# Altium schematic sheet BUS REG, BA MUX.SchDoc: DATAPATHS
size A3; Date: .Date; Author: Jeremy King; CompanyName: King Technologies; DrawnBy: Jeremy King; Engineer: Jeremy King; Organization: King Technologies; Address1: 676 Mandan Ave,; Address2: Melbourne,; Address3: FL,; Address4: 32935; DocumentNumber: 1; Revision: 1; SheetNumber: 1; SheetTotal: 3; ProjectTitle: Siena; Time: .Time
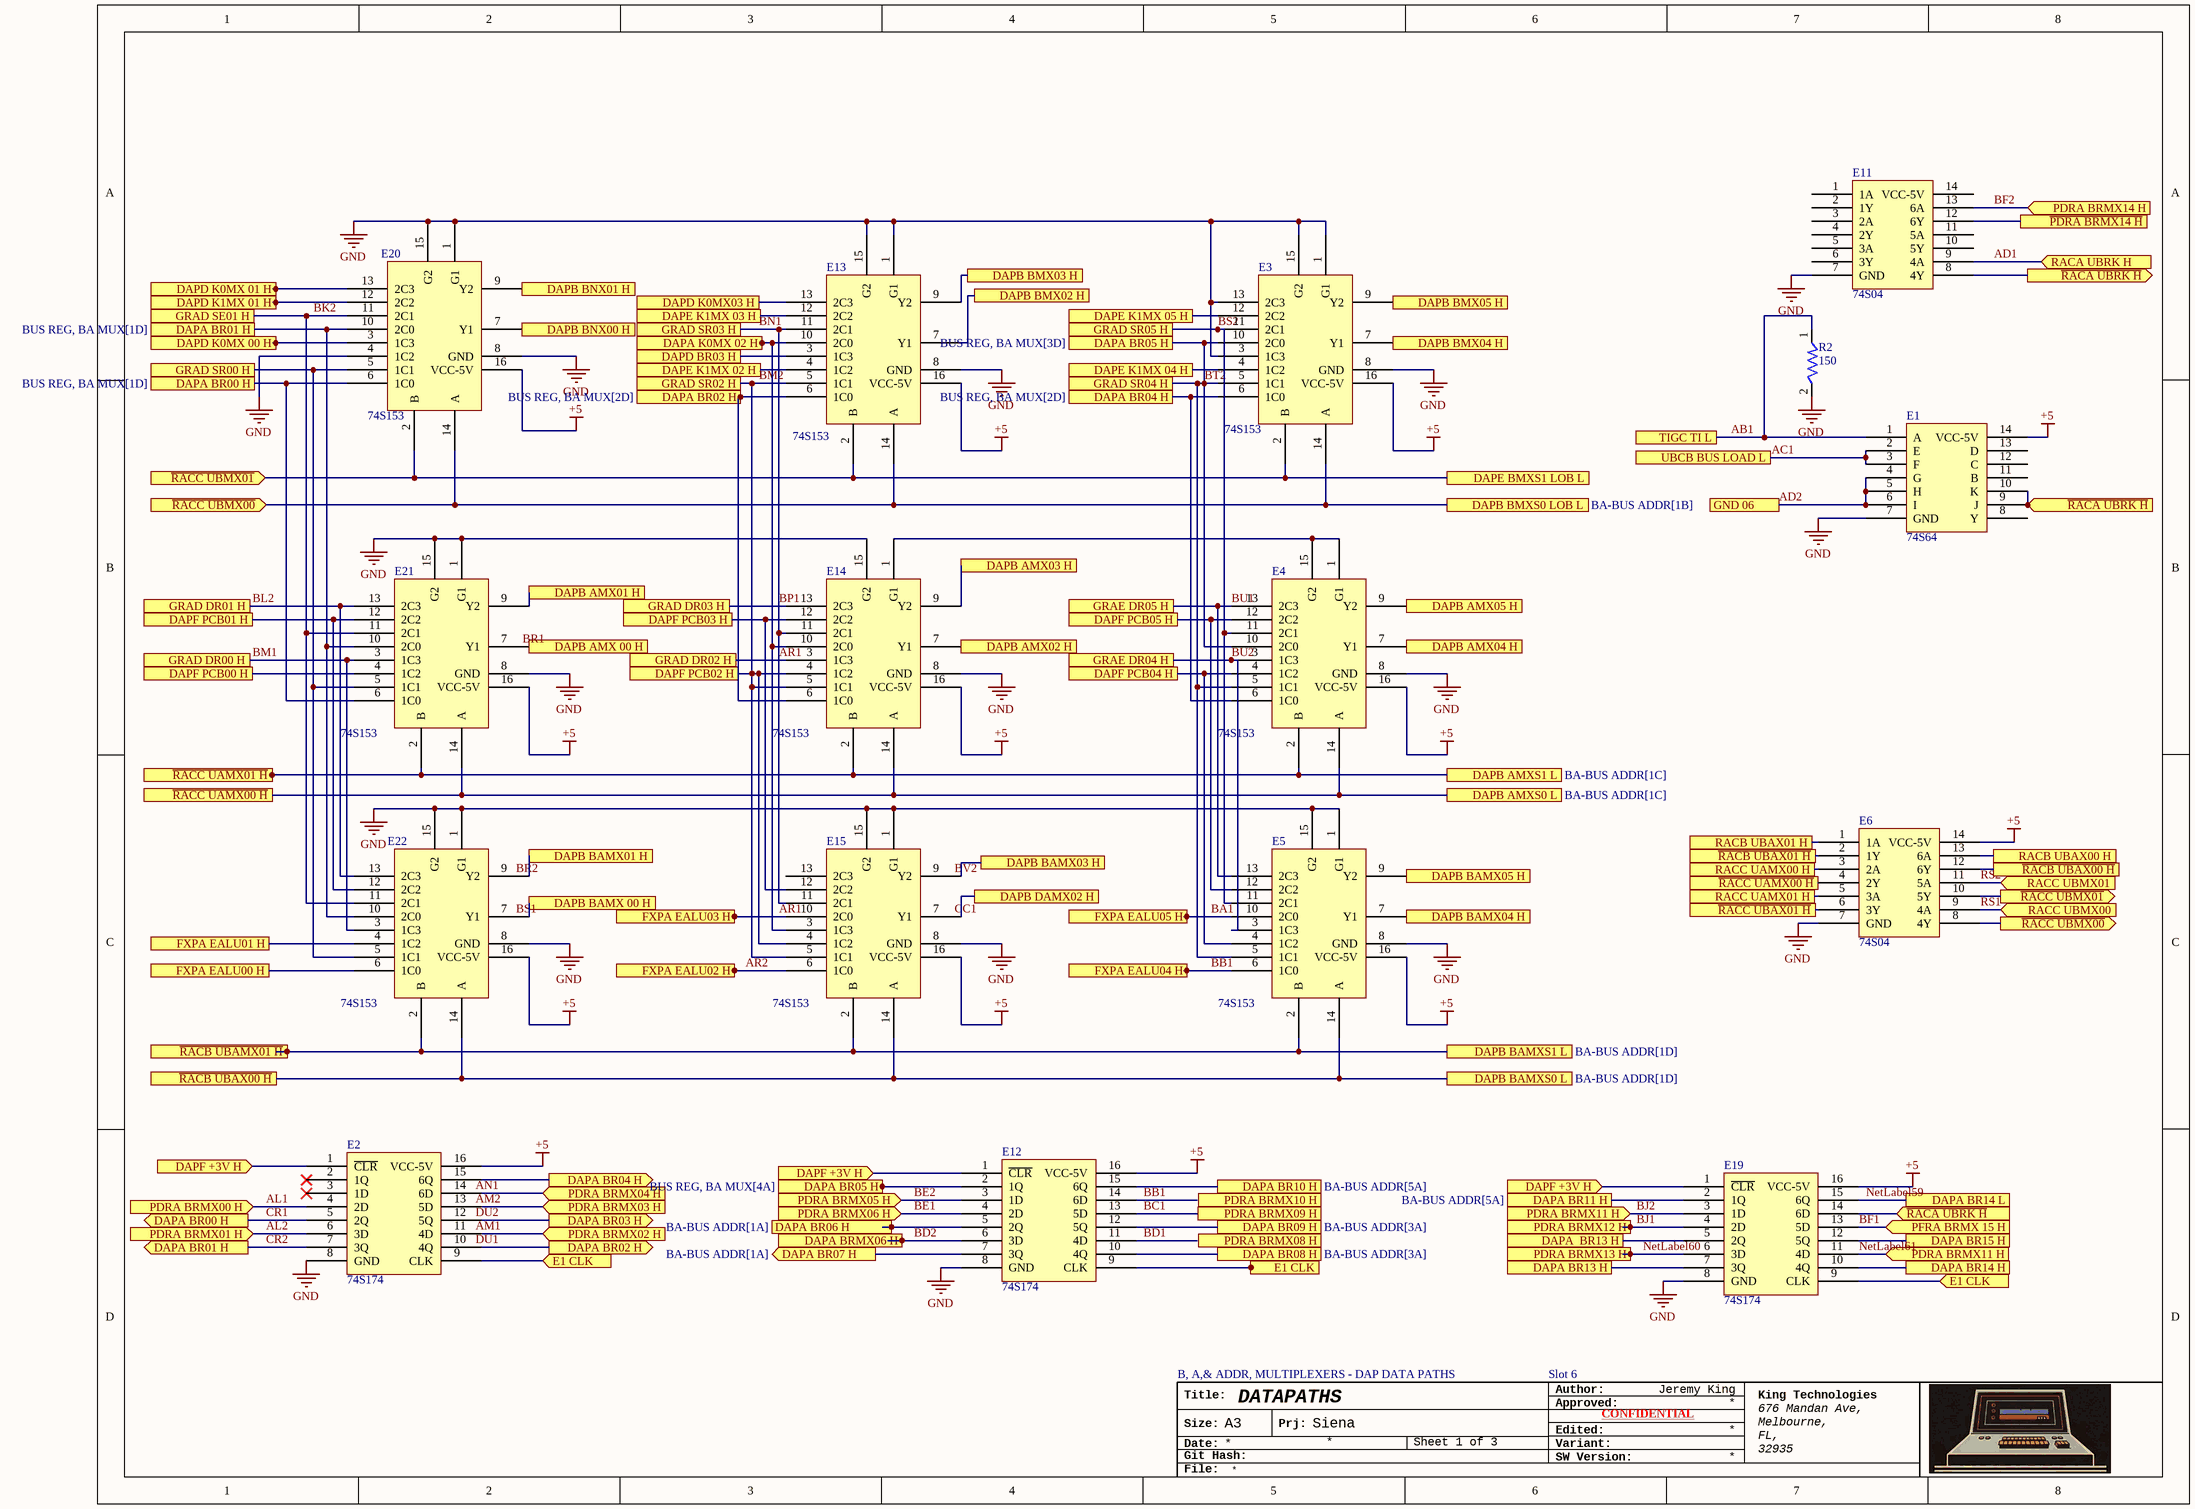
[diagram p0: BUS REG, BA MUX.SchDoc]

## Parts
E1  74S64  [DIP14]
E2  74S174  [DIP16-300]
E3  74S153  [DIP16]
E4  74S153  [DIP16]
E5  74S153  [DIP16]
E6  74S04  [DIP14]
E11  74S04  [DIP14]
E12  74S174  [DIP16-300]
E13  74S153  [DIP16]
E14  74S153  [DIP16]
E15  74S153  [DIP16]
E19  74S174  [DIP16-300]
E20  74S153  [DIP16]
E21  74S153  [DIP16]
E22  74S153  [DIP16]
R2  150  [Axial 0.6]

## Ports
DAPA  BR13 H, DAPA BR00 H (out, see BUS REG, BA MUX[1B]), DAPA BR00 H (see BUS REG, BA MUX[1D]), DAPA BR01 H (out, see BUS REG, BA MUX[1A]), DAPA BR01 H (see BUS REG, BA MUX[1D]), DAPA BR02 H (out, see BUS REG, BA MUX[3B]), DAPA BR02 H (see BUS REG, BA MUX[2D]), DAPA BR03 H (out), DAPA BR04 H (out, see BUS REG, BA MUX[4B]), DAPA BR04 H (see BUS REG, BA MUX[2D]), DAPA BR05 H (see BUS REG, BA MUX[3D]), DAPA BR05 H (see BUS REG, BA MUX[4A]), DAPA BR06 H (out, see BA-BUS ADDR[1A]), DAPA BR07 H (out, see BA-BUS ADDR[1A]), DAPA BR08 H (see BA-BUS ADDR[3A]), DAPA BR09 H (see BA-BUS ADDR[3A]), DAPA BR10 H (see BA-BUS ADDR[5A]), DAPA BR11 H (see BA-BUS ADDR[5A]), DAPA BR13 H, DAPA BR14 H, DAPA BR14 L, DAPA BR15 H, DAPA BRMX06 H (in), DAPA K0MX 02 H, DAPB AMX01 H, DAPB AMX02 H, DAPB AMX03 H, DAPB AMX04 H, DAPB AMX05 H, DAPB AMX 00 H, DAPB AMXS0 L (see BA-BUS ADDR[1C]), DAPB AMXS1 L (see BA-BUS ADDR[1C]), DAPB BAMX01 H, DAPB BAMX03 H, DAPB BAMX04 H, DAPB BAMX05 H, DAPB BAMX 00 H, DAPB BAMXS0 L (see BA-BUS ADDR[1D]), DAPB BAMXS1 L (see BA-BUS ADDR[1D]), DAPB BMX02 H, DAPB BMX03 H, DAPB BMX04 H, DAPB BMX05 H, DAPB BMXS0 LOB L (see BA-BUS ADDR[1B]), DAPB BNX00 H, DAPB BNX01 H, DAPB DAMX02 H, DAPD BR03 H, DAPD K0MX03 H, DAPD K0MX 00 H, DAPD K0MX 01 H, DAPD K1MX 01 H, DAPE BMXS1 LOB L, DAPE K1MX 02 H, DAPE K1MX 03 H, DAPE K1MX 04 H, DAPE K1MX 05 H, DAPF +3V H (in, see BUS REG, BA MUX[1D], BUS REG, BA MUX[3D]), DAPF +3V H (in, see BUS REG, BA MUX[1D], BUS REG, BA MUX[6D]), DAPF +3V H (in, see BUS REG, BA MUX[3D], BUS REG, BA MUX[6D]), DAPF PCB00 H, DAPF PCB01 H, DAPF PCB02 H, DAPF PCB03 H, DAPF PCB04 H, DAPF PCB05 H, E1 CLK (in, see BUS REG, BA MUX[2D], BUS REG, BA MUX[5D]), E1 CLK (in, see BUS REG, BA MUX[2D], BUS REG, BA MUX[8D]), E1 CLK (in, see BUS REG, BA MUX[5D], BUS REG, BA MUX[8D]), FXPA EALU00 H, FXPA EALU01 H, FXPA EALU02 H, FXPA EALU03 H, FXPA EALU04 H, FXPA EALU05 H, GND 06, GRAD DR00 H, GRAD DR01 H, GRAD DR02 H, GRAD DR03 H, GRAD SE01 H, GRAD SR00 H, GRAD SR02 H, GRAD SR03 H, GRAD SR04 H, GRAD SR05 H, GRAE DR04 H, GRAE DR05 H, PDRA BRMX00 H (in), PDRA BRMX01 H (in), PDRA BRMX02 H (in), PDRA BRMX03 H (in), PDRA BRMX04 H (in), PDRA BRMX05 H (in), PDRA BRMX06 H (in), PDRA BRMX08 H (in), PDRA BRMX09 H (in), PDRA BRMX10 H (in), PDRA BRMX11 H (in, see BUS REG, BA MUX[6D]), PDRA BRMX11 H (in, see BUS REG, BA MUX[7D]), PDRA BRMX12 H (in), PDRA BRMX13 H (in), PDRA BRMX14 H (in), PFRA BRMX 15 H (in), RACA UBRK H (in), RACB UBAX00 H, RACB UBAX01 H, RACC UAMX00 H, RACC UAMX01 H, RACC UBMX00 (in), RACC UBMX01 (in), TIGC TI L, UBCB BUS LOAD L, ~{PDRA BRMX14 H}, ~{RACA UBRK H} (in, see BUS REG, BA MUX[7D], BUS REG, BA MUX[8A]), ~{RACA UBRK H} (in, see BUS REG, BA MUX[8A], BUS REG, BA MUX[8B]), ~{RACA UBRK H} (out, see BUS REG, BA MUX[7D], BUS REG, BA MUX[8B]), ~{RACB UBAMX01 H}, ~{RACB UBAX00 H} (see BUS REG, BA MUX[1C]), ~{RACB UBAX00 H} (see BUS REG, BA MUX[8C]), ~{RACB UBAX01 H}, ~{RACC UAMX00 H} (see BUS REG, BA MUX[1C]), ~{RACC UAMX00 H} (see BUS REG, BA MUX[7C]), ~{RACC UAMX01 H}, ~{RACC UBAX01 H}, ~{RACC UBMX00} (in, see BUS REG, BA MUX[8C]), ~{RACC UBMX00} (out, see BUS REG, BA MUX[1B]), ~{RACC UBMX01} (in, see BUS REG, BA MUX[8C]), ~{RACC UBMX01} (out, see BUS REG, BA MUX[1B])

## Nets
+5: E1.14(VCC-5V) E2.16(VCC-5V) E3.16(VCC-5V) E4.16(VCC-5V) E5.16(VCC-5V) E6.14(VCC-5V) E12.16(VCC-5V) E13.16(VCC-5V) E14.16(VCC-5V) E15.16(VCC-5V) E19.16(VCC-5V) E20.16(VCC-5V) E21.16(VCC-5V) E22.16(VCC-5V)
GND: E1.7(GND) E2.8(GND) E3.1(G1) E3.3(1C3) E3.8(GND) E3.13(2C3) E3.15(G2) E4.8(GND) E5.1(G1) E5.8(GND) E5.15(G2) E6.7(GND) E11.7(GND) E12.8(GND) E13.1(G1) E13.8(GND) E13.15(G2) E14.8(GND) E14.15(G2) E15.1(G1) E15.8(GND) E15.15(G2) E19.8(GND) E20.1(G1) E20.4(1C2) E20.8(GND) E20.15(G2) E21.1(G1) E21.8(GND) E21.15(G2) E22.1(G1) E22.8(GND) E22.15(G2) R2.2
~{PDRA BRMX14 H}: E11.12(6Y) ; port ~{PDRA BRMX14 H}
~{RACA UBRK H}: E1.9(J) E1.10(K) E11.8(4Y) E19.14(6D) ; port ~{RACA UBRK H}
~{RACB UBAMX01 H}: E5.2(B) E15.2(B) E22.2(B) ; port ~{RACB UBAMX01 H}, port DAPB BAMXS1 L
~{RACB UBAX00 H}: E5.14(A) E6.12(6Y) E15.14(A) E22.14(A) ; port ~{RACB UBAX00 H}, port DAPB BAMXS0 L
~{RACB UBAX01 H}: E6.2(1Y) ; port ~{RACB UBAX01 H}
~{RACC UAMX00 H}: E4.14(A) E6.4(2Y) E14.14(A) E21.14(A) ; port ~{RACC UAMX00 H}, port DAPB AMXS0 L
~{RACC UAMX01 H}: E4.2(B) E14.2(B) E21.2(B) ; port ~{RACC UAMX01 H}, port DAPB AMXS1 L
~{RACC UBAX01 H}: E6.6(3Y) ; port ~{RACC UBAX01 H}
~{RACC UBMX00}: E3.14(A) E6.8(4Y) E13.14(A) E20.14(A) ; port DAPB BMXS0 LOB L, port ~{RACC UBMX00}
~{RACC UBMX01}: E3.2(B) E6.10(5Y) E13.2(B) E20.2(B) ; port DAPE BMXS1 LOB L, port ~{RACC UBMX01}
AB1: E1.1(A) R2.1 ; port TIGC TI L
AC1: E1.2(E) E1.3(F) ; port UBCB BUS LOAD L
AD1: E11.9(4A) ; port RACA UBRK H
AD2: E1.4(G) E1.5(H) E1.6(I) ; port GND 06
AL1: E2.4(2D) ; port PDRA BRMX00 H
AL2: E2.6(3D) ; port PDRA BRMX01 H
AR1: E13.11(2C1) E14.3(1C3) E14.11(2C1) E14.13(2C3) E15.10(2C0) E15.11(2C1) ; port GRAD SR03 H, port GRAD DR03 H, port GRAD DR02 H, port FXPA EALU03 H  [also labelled BN1, BP1]
AR2: E15.6(1C0) ; port FXPA EALU02 H
BA1: E5.10(2C0) ; port FXPA EALU05 H
BB1: E5.6(1C0) E12.14(6D) ; port FXPA EALU04 H
BC1: E12.13(5D)
BD1: E12.11(4D)
BD2: E12.6(3D) ; port DAPA BRMX06 H
BE1: E12.4(2D) ; port PDRA BRMX06 H
BE2: E12.3(1D) ; port PDRA BRMX05 H
BF1: E19.13(5D) ; port PFRA BRMX 15 H
BF2: E11.13(6A) ; port PDRA BRMX14 H
BJ1: E19.4(2D) ; port PDRA BRMX12 H
BJ2: E19.3(1D) E19.11(4D) ; port PDRA BRMX11 H  [also labelled NetLabel61]
BK2: E20.11(2C1) E21.11(2C1) E22.11(2C1) ; port GRAD SE01 H
BL2: E21.13(2C3) E22.13(2C3) ; port GRAD DR01 H
BM1: E21.3(1C3) E22.3(1C3) ; port GRAD DR00 H
BM2: E13.5(1C1) E14.4(1C2) E14.5(1C1) E15.4(1C2) E15.5(1C1) ; port GRAD SR02 H, port DAPF PCB02 H
BS2: E3.11(2C1) E4.11(2C1) E5.11(2C1) ; port GRAD SR05 H
BT2: E3.5(1C1) E3.10(2C0) E4.5(1C1) E4.10(2C0) E5.5(1C1) E12.2(1Q) ; port DAPA BR05 H, port GRAD SR04 H
BU1: E4.13(2C3) E5.13(2C3) ; port GRAE DR05 H
BU2: E4.3(1C3) E5.3(1C3) ; port GRAE DR04 H
CR1: E2.5(2Q) E20.6(1C0) E21.6(1C0) ; port DAPA BR00 H
CR2: E2.7(3Q) E20.10(2C0) E21.10(2C0) E22.10(2C0) ; port DAPA BR01 H
DAPA  BR13 H: E19.5(2Q) ; port DAPA  BR13 H
DAPA BR02 H: E2.10(4Q) E13.6(1C0) E14.6(1C0) ; port DAPA BR02 H
DAPA BR03 H: E2.12(5Q) ; port DAPA BR03 H
DAPA BR04 H: E2.15(6Q) E3.6(1C0) E4.6(1C0) ; port DAPA BR04 H
DAPA BR06 H: E12.5(2Q) ; port DAPA BR06 H
DAPA BR07 H: E12.7(3Q) ; port DAPA BR07 H
DAPA BR08 H: E12.10(4Q) ; port DAPA BR08 H
DAPA BR09 H: E12.12(5Q) ; port DAPA BR09 H
DAPA BR10 H: E12.15(6Q) ; port DAPA BR10 H
DAPA BR11 H: E19.2(1Q) ; port DAPA BR11 H
DAPA BR13 H: E19.7(3Q) ; port DAPA BR13 H
DAPA BR14 H: E19.10(4Q) ; port DAPA BR14 H
DAPA BR15 H: E19.12(5Q) ; port DAPA BR15 H
DAPA K0MX 02 H: E13.10(2C0) E14.10(2C0) E15.3(1C3) ; port DAPA K0MX 02 H
DAPB AMX01 H: E21.9(Y2) ; port DAPB AMX01 H
DAPB AMX02 H: E14.7(Y1) ; port DAPB AMX02 H
DAPB AMX03 H: E14.9(Y2) ; port DAPB AMX03 H
DAPB AMX04 H: E4.7(Y1) ; port DAPB AMX04 H
DAPB AMX05 H: E4.9(Y2) ; port DAPB AMX05 H
DAPB AMX 00 H: E21.7(Y1) ; port DAPB AMX 00 H
DAPB BAMX01 H: E22.9(Y2) ; port DAPB BAMX01 H
DAPB BAMX03 H: E15.9(Y2) ; port DAPB BAMX03 H
DAPB BAMX04 H: E5.7(Y1) ; port DAPB BAMX04 H
DAPB BAMX05 H: E5.9(Y2) ; port DAPB BAMX05 H
DAPB BAMX 00 H: E22.7(Y1) ; port DAPB BAMX 00 H
DAPB BMX02 H: E13.7(Y1) ; port DAPB BMX02 H
DAPB BMX03 H: E13.9(Y2) ; port DAPB BMX03 H
DAPB BMX04 H: E3.7(Y1) ; port DAPB BMX04 H
DAPB BMX05 H: E3.9(Y2) ; port DAPB BMX05 H
DAPB BNX00 H: E20.7(Y1) ; port DAPB BNX00 H
DAPB BNX01 H: E20.9(Y2) ; port DAPB BNX01 H
DAPB DAMX02 H: E15.7(Y1) ; port DAPB DAMX02 H
DAPD BR03 H: E13.3(1C3) ; port DAPD BR03 H
DAPD K0MX03 H: E13.13(2C3) ; port DAPD K0MX03 H
DAPD K0MX 00 H: E20.3(1C3) ; port DAPD K0MX 00 H
DAPD K0MX 01 H: E20.13(2C3) ; port DAPD K0MX 01 H
DAPD K1MX 01 H: E20.12(2C2) ; port DAPD K1MX 01 H
DAPE K1MX 02 H: E13.4(1C2) ; port DAPE K1MX 02 H
DAPE K1MX 03 H: E13.12(2C2) ; port DAPE K1MX 03 H
DAPE K1MX 04 H: E3.4(1C2) ; port DAPE K1MX 04 H
DAPE K1MX 05 H: E3.12(2C2) ; port DAPE K1MX 05 H
DAPF +3V H: E2.1(~{CLR}) E12.1(~{CLR}) E19.1(~{CLR}) ; port DAPF +3V H
DAPF PCB00 H: E21.4(1C2) ; port DAPF PCB00 H
DAPF PCB01 H: E21.12(2C2) E22.12(2C2) ; port DAPF PCB01 H
DAPF PCB03 H: E14.12(2C2) E15.12(2C2) ; port DAPF PCB03 H
DAPF PCB04 H: E4.4(1C2) E5.4(1C2) ; port DAPF PCB04 H
DAPF PCB05 H: E4.12(2C2) E5.12(2C2) ; port DAPF PCB05 H
E1 CLK: E2.9(CLK) E12.9(CLK) E19.9(CLK) ; port E1 CLK
FXPA EALU00 H: E22.6(1C0) ; port FXPA EALU00 H
FXPA EALU01 H: E22.4(1C2) ; port FXPA EALU01 H
GRAD SR00 H: E20.5(1C1) E21.5(1C1) E22.5(1C1) ; port GRAD SR00 H
NetLabel59: E19.15(6Q) ; port DAPA BR14 L
NetLabel60: E19.6(3D) ; port PDRA BRMX13 H
PDRA BRMX02 H: E2.11(4D) ; port PDRA BRMX02 H
PDRA BRMX03 H: E2.13(5D) ; port PDRA BRMX03 H
PDRA BRMX04 H: E2.14(6D) ; port PDRA BRMX04 H
RACB UBAX00 H: E6.13(6A) ; port RACB UBAX00 H
RACB UBAX01 H: E6.1(1A) ; port RACB UBAX01 H
RACC UAMX00 H: E6.3(2A) ; port RACC UAMX00 H
RACC UAMX01 H: E6.5(3A) ; port RACC UAMX01 H
RS1: E6.9(4A) ; port RACC UBMX00
RS2: E6.11(5A) ; port RACC UBMX01
NetE4_1: E4.1(G1) E4.15(G2) E14.1(G1)

Not connected (* = marked no-connect by the designer): E1 8(Y) 11(B) 12(C) 13(D); E2 2(1Q)* 3(1D)*; E11 1(1A) 2(1Y) 3(2A) 4(2Y) 5(3A) 6(3Y) 10(5Y) 11(5A) 14(VCC-5V); E15 13(2C3)

## Notes on the sheet
- B, A,& ADDR, MULTIPLEXERS - DAP DATA PATHS
- Slot 6
- Labels drawn without touching a wire or pin: AM1, AM2, AN1, BR1, BR2, BS1, BV2, CC1, DU1, DU2
- Title:
- Author:
- Approved:
- Size:
- Date:
- Git Hash:
- A3
- Prj:
- SW Version:
- Variant:
- Edited:
- CONFIDENTIAL
- File:

## Library data of the parts
R2 = Resistor: Supplier 1: Digikey; Supplier Part Number 1: 2019-CF1/4C561J-ND; Supplier 2: Digikey; Supplier Part Number 2: 273-OK1515E-R52CT-ND
E2 E12 E19 = 74S174: Supplier 1: Rochester Electronics; Supplier Part Number 1: SN74S174N
E3-E5 E13-E15 E20-E22 = 74S153: Supplier 1: Rochester Electronics; Supplier Part Number 1: DM74S153N
E6 E11 = 74S04: Supplier 1: Mouser; Supplier Part Number 1: 595-SN74S04N